# Altium schematic sheet Sheet2.SchDoc
size A2
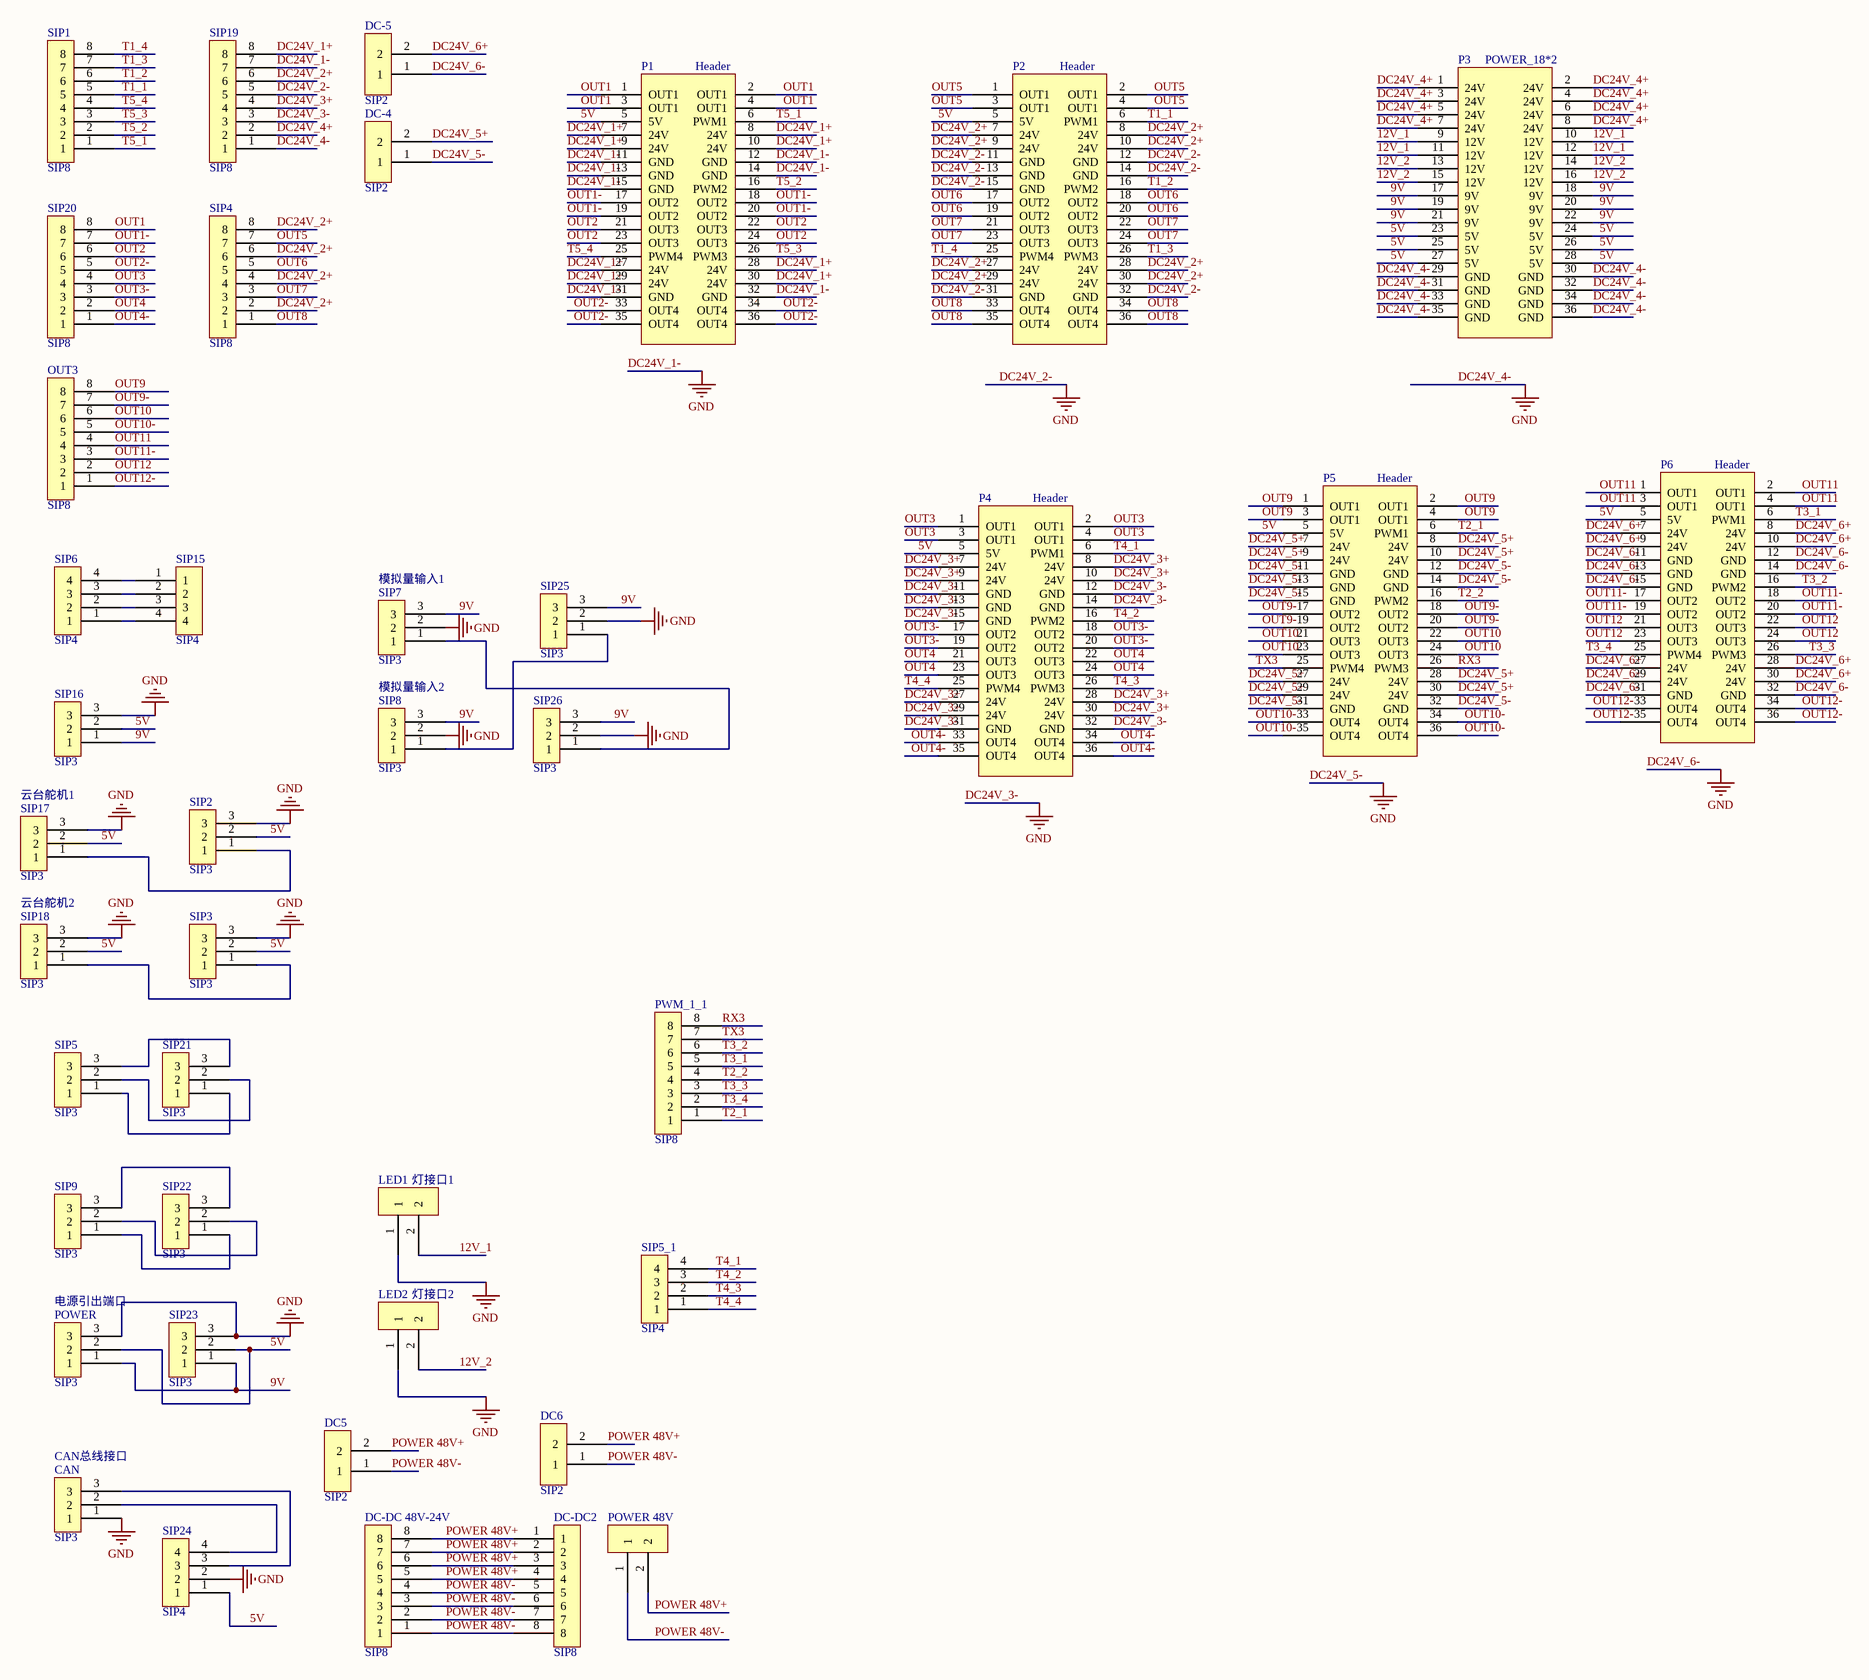
[diagram p0: Sheet2.SchDoc]

## Parts
CAN  SIP3  [SIP3]
DC5  SIP2  [DIP2-3MM-K]
DC6  SIP2  [DIP2-3MM-K]
DC-4  SIP2  [DIP2-3MM-K]
DC-5  SIP2  [DIP2-3MM-K]
DC-DC2  SIP8  [DIP8-3MM]
DC-DC_48V-24V  SIP8  [DIP8-3MM]
LED1  SIP2  [SIP2-3MM]  (value not drawn)
LED2  SIP2  [SIP2-3MM]  (value not drawn)
OUT3  SIP8  [DIP8-3MM]
P1  Header  [DIP36-3.96MM]
P2  Header  [DIP36-3.96MM]
P3  POWER_18*2  [DIP36-3.96MM]
P4  Header  [DIP36-3.96MM]
P5  Header  [DIP36-3.96MM]
P6  Header  [DIP36-3.96MM]
POWER  SIP3  [SIP3]
POWER_48V  SIP2  [SIP2-3MM]  (value not drawn)
PWM_1_1  SIP8  [SIP8]
SIP1  SIP8  [SIP8]
SIP2  SIP3  [SIP3]
SIP3  SIP3  [SIP3]
SIP4  SIP8  [DIP8-3MM]
SIP5  SIP3  [SIP3]
SIP5_1  SIP4  [SIP4]
SIP6  SIP4  [SIP4]
SIP7  SIP3  [SIP3]
SIP8  SIP3  [SIP3]
SIP9  SIP3  [SIP3]
SIP15  SIP4  [SIP4]
SIP16  SIP3  [SIP3]
SIP17  SIP3  [SIP3]
SIP18  SIP3  [SIP3]
SIP19  SIP8  [DIP8-3MM]
SIP20  SIP8  [DIP8-3MM]
SIP21  SIP3  [SIP3]
SIP22  SIP3  [SIP3]
SIP23  SIP3  [SIP3]
SIP24  SIP4  [SIP4]
SIP25  SIP3  [SIP3]
SIP26  SIP3  [SIP3]

## Nets
DC24V_1-: CAN.1 DC-4.1 DC-5.1 LED1.1 LED2.1 P1.11(GND) P1.12(GND) P1.13(GND) P1.14(GND) P1.15(GND) P1.31(GND) P1.32(GND) P2.11(GND) P2.12(GND) P2.13(GND) P2.14(GND) P2.15(GND) P2.31(GND) P2.32(GND) P3.29(GND) P3.30(GND) P3.31(GND) P3.32(GND) P3.33(GND) P3.34(GND) P3.35(GND) P3.36(GND) P4.11(GND) P4.12(GND) P4.13(GND) P4.14(GND) P4.15(GND) P4.31(GND) P4.32(GND) P5.11(GND) P5.12(GND) P5.13(GND) P5.14(GND) P5.15(GND) P5.31(GND) P5.32(GND) P6.11(GND) P6.12(GND) P6.13(GND) P6.14(GND) P6.15(GND) P6.31(GND) P6.32(GND) POWER.3 SIP2.3 SIP3.3 SIP7.2 SIP8.2 SIP16.3 SIP17.3 SIP18.3 SIP19.1 SIP19.3 SIP19.5 SIP19.7 SIP23.3 SIP24.2 SIP25.2 SIP26.2  [also labelled DC24V_2-, DC24V_3-, DC24V_4-, DC24V_5-, DC24V_6-, GND]
5V: P1.5(5V) P2.5(5V) P3.23(5V) P3.24(5V) P3.25(5V) P3.26(5V) P3.27(5V) P3.28(5V) P4.5(5V) P5.5(5V) P6.5(5V) POWER.2 SIP2.2 SIP3.2 SIP16.2 SIP17.2 SIP18.2 SIP23.2 SIP24.1
9V: P3.17(9V) P3.18(9V) P3.19(9V) P3.20(9V) P3.21(9V) P3.22(9V) POWER.1 SIP7.3 SIP8.3 SIP16.1 SIP23.1 SIP25.3 SIP26.3
12V_1: LED1.2 P3.9(12V) P3.10(12V) P3.11(12V) P3.12(12V)
12V_2: LED2.2 P3.13(12V) P3.14(12V) P3.15(12V) P3.16(12V)
DC24V_1+: P1.7(24V) P1.8(24V) P1.9(24V) P1.10(24V) P1.27(24V) P1.28(24V) P1.29(24V) P1.30(24V) SIP19.8
DC24V_2+: P2.7(24V) P2.8(24V) P2.9(24V) P2.10(24V) P2.27(24V) P2.28(24V) P2.29(24V) P2.30(24V) SIP4.2 SIP4.4 SIP4.6 SIP4.8 SIP19.6
DC24V_3+: P4.7(24V) P4.8(24V) P4.9(24V) P4.10(24V) P4.27(24V) P4.28(24V) P4.29(24V) P4.30(24V) SIP19.4
DC24V_4+: P3.1(24V) P3.2(24V) P3.3(24V) P3.4(24V) P3.5(24V) P3.6(24V) P3.7(24V) P3.8(24V) SIP19.2
DC24V_5+: DC-4.2 P5.7(24V) P5.8(24V) P5.9(24V) P5.10(24V) P5.27(24V) P5.28(24V) P5.29(24V) P5.30(24V)
DC24V_6+: DC-5.2 P6.7(24V) P6.8(24V) P6.9(24V) P6.10(24V) P6.27(24V) P6.28(24V) P6.29(24V) P6.30(24V)
OUT1: P1.1(OUT1) P1.2(OUT1) P1.3(OUT1) P1.4(OUT1) SIP20.8
OUT1-: P1.17(OUT2) P1.18(OUT2) P1.19(OUT2) P1.20(OUT2) SIP20.7
OUT2: P1.21(OUT3) P1.22(OUT3) P1.23(OUT3) P1.24(OUT3) SIP20.6
OUT2-: P1.33(OUT4) P1.34(OUT4) P1.35(OUT4) P1.36(OUT4) SIP20.5
OUT3: P4.1(OUT1) P4.2(OUT1) P4.3(OUT1) P4.4(OUT1) SIP20.4
OUT3-: P4.17(OUT2) P4.18(OUT2) P4.19(OUT2) P4.20(OUT2) SIP20.3
OUT4: P4.21(OUT3) P4.22(OUT3) P4.23(OUT3) P4.24(OUT3) SIP20.2
OUT4-: P4.33(OUT4) P4.34(OUT4) P4.35(OUT4) P4.36(OUT4) SIP20.1
OUT5: P2.1(OUT1) P2.2(OUT1) P2.3(OUT1) P2.4(OUT1) SIP4.7
OUT6: P2.17(OUT2) P2.18(OUT2) P2.19(OUT2) P2.20(OUT2) SIP4.5
OUT7: P2.21(OUT3) P2.22(OUT3) P2.23(OUT3) P2.24(OUT3) SIP4.3
OUT8: P2.33(OUT4) P2.34(OUT4) P2.35(OUT4) P2.36(OUT4) SIP4.1
OUT9: OUT3.8 P5.1(OUT1) P5.2(OUT1) P5.3(OUT1) P5.4(OUT1)
OUT9-: OUT3.7 P5.17(OUT2) P5.18(OUT2) P5.19(OUT2) P5.20(OUT2)
OUT10: OUT3.6 P5.21(OUT3) P5.22(OUT3) P5.23(OUT3) P5.24(OUT3)
OUT10-: OUT3.5 P5.33(OUT4) P5.34(OUT4) P5.35(OUT4) P5.36(OUT4)
OUT11: OUT3.4 P6.1(OUT1) P6.2(OUT1) P6.3(OUT1) P6.4(OUT1)
OUT11-: OUT3.3 P6.17(OUT2) P6.18(OUT2) P6.19(OUT2) P6.20(OUT2)
OUT12: OUT3.2 P6.21(OUT3) P6.22(OUT3) P6.23(OUT3) P6.24(OUT3)
OUT12-: OUT3.1 P6.33(OUT4) P6.34(OUT4) P6.35(OUT4) P6.36(OUT4)
POWER 48V+: DC5.2 DC6.2 DC-DC2.1 DC-DC2.2 DC-DC2.3 DC-DC2.4 DC-DC_48V-24V.5 DC-DC_48V-24V.6 DC-DC_48V-24V.7 DC-DC_48V-24V.8 POWER_48V.2
POWER 48V-: DC5.1 DC6.1 DC-DC2.5 DC-DC2.6 DC-DC2.7 DC-DC2.8 DC-DC_48V-24V.1 DC-DC_48V-24V.2 DC-DC_48V-24V.3 DC-DC_48V-24V.4 POWER_48V.1
RX3: P5.26(PWM3) PWM_1_1.8
T1_1: P2.6(PWM1) SIP1.5
T1_2: P2.16(PWM2) SIP1.6
T1_3: P2.26(PWM3) SIP1.7
T1_4: P2.25(PWM4) SIP1.8
T2_1: P5.6(PWM1) PWM_1_1.1
T2_2: P5.16(PWM2) PWM_1_1.4
T3_1: P6.6(PWM1) PWM_1_1.5
T3_2: P6.16(PWM2) PWM_1_1.6
T3_3: P6.26(PWM3) PWM_1_1.3
T3_4: P6.25(PWM4) PWM_1_1.2
T4_1: P4.6(PWM1) SIP5_1.4
T4_2: P4.16(PWM2) SIP5_1.3
T4_3: P4.26(PWM3) SIP5_1.2
T4_4: P4.25(PWM4) SIP5_1.1
T5_1: P1.6(PWM1) SIP1.1
T5_2: P1.16(PWM2) SIP1.2
T5_3: P1.26(PWM3) SIP1.3
T5_4: P1.25(PWM4) SIP1.4
TX3: P5.25(PWM4) PWM_1_1.7
NetCAN_2: CAN.2 SIP24.4
NetCAN_3: CAN.3 SIP24.3
NetSIP2_1: SIP2.1 SIP17.1
NetSIP3_1: SIP3.1 SIP18.1
NetSIP5_1: SIP5.1 SIP21.1
NetSIP5_2: SIP5.2 SIP21.2
NetSIP5_3: SIP5.3 SIP21.3
NetSIP6_1: SIP6.1 SIP15.4
NetSIP6_2: SIP6.2 SIP15.3
NetSIP6_3: SIP6.3 SIP15.2
NetSIP6_4: SIP6.4 SIP15.1
NetSIP7_1: SIP7.1 SIP26.1
NetSIP8_1: SIP8.1 SIP25.1
NetSIP9_1: SIP9.1 SIP22.1
NetSIP9_2: SIP9.2 SIP22.2
NetSIP9_3: SIP9.3 SIP22.3

## Notes on the sheet
- (near SIP7) 模拟量输入1
- 模拟量输入2
- (near SIP17) 云台舵机1
- 云台舵机2
- (near LED1) 灯接口1
- (near POWER) 电源引出端口
- (near LED2) 灯接口2
- (near CAN) CAN总线接口